# EAGLE schematic module_RevD_panelized (EAGLE 9.1.1)
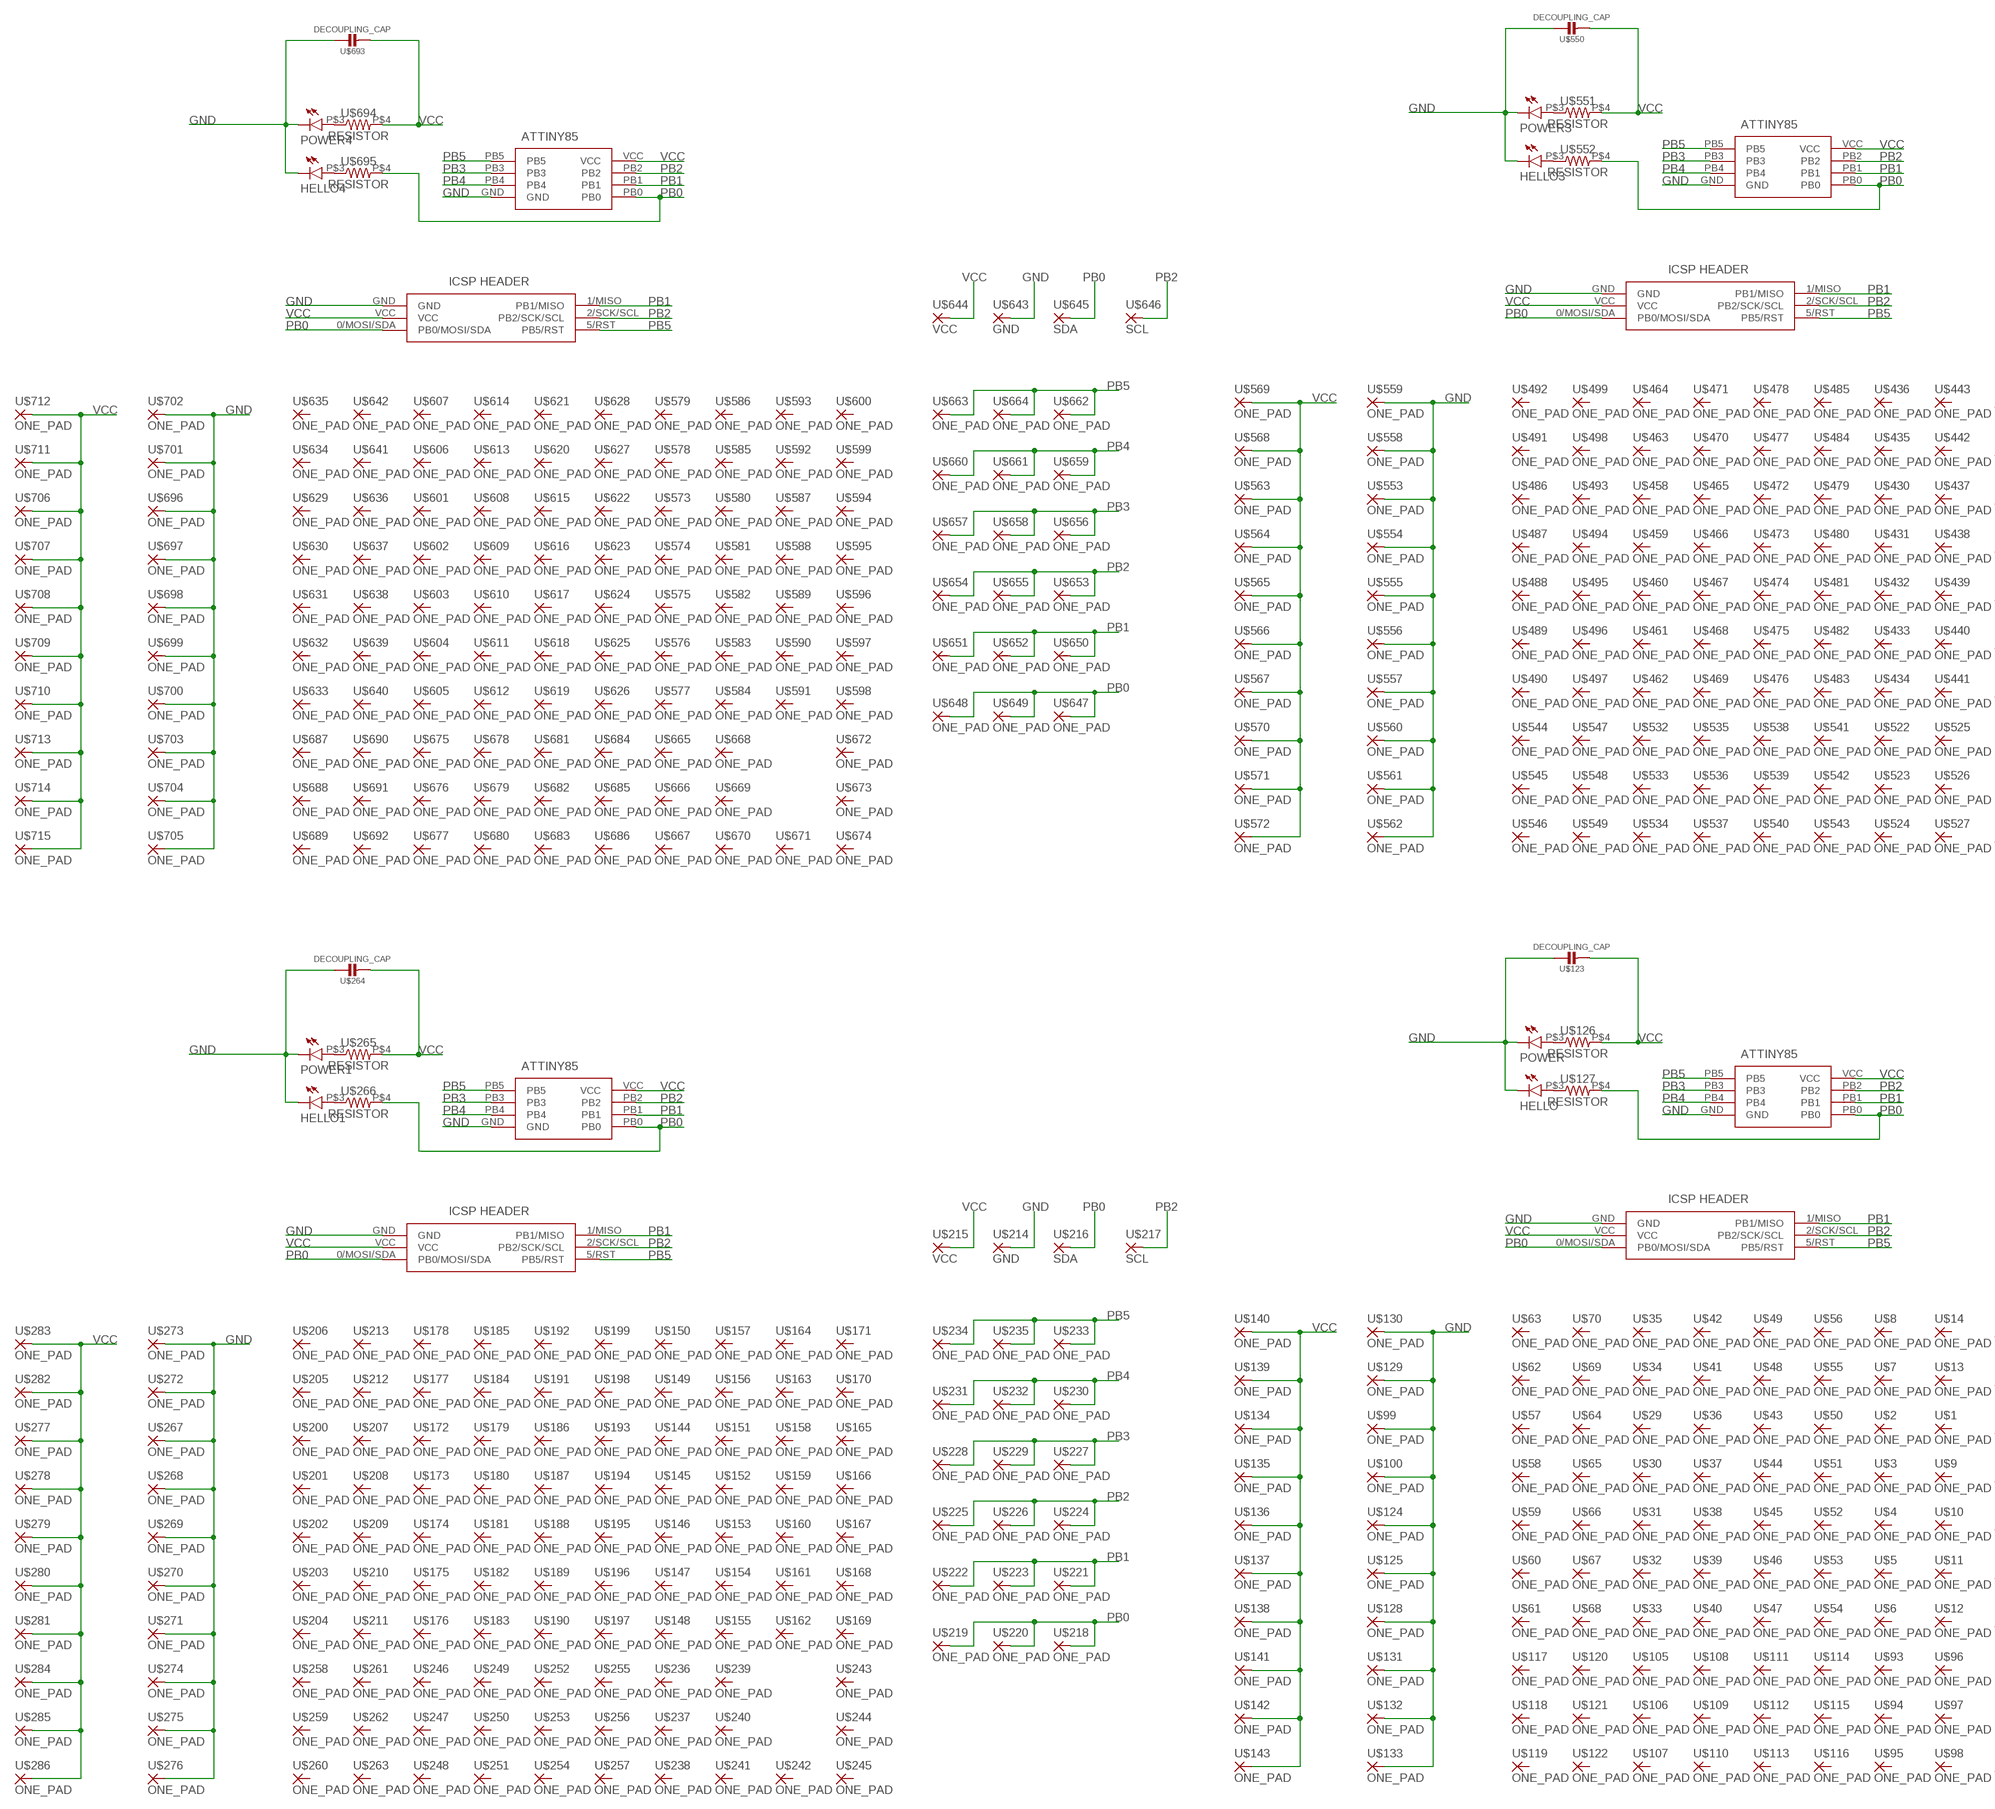
[diagram p0: schematic, sheet 1, part 1 of 2]
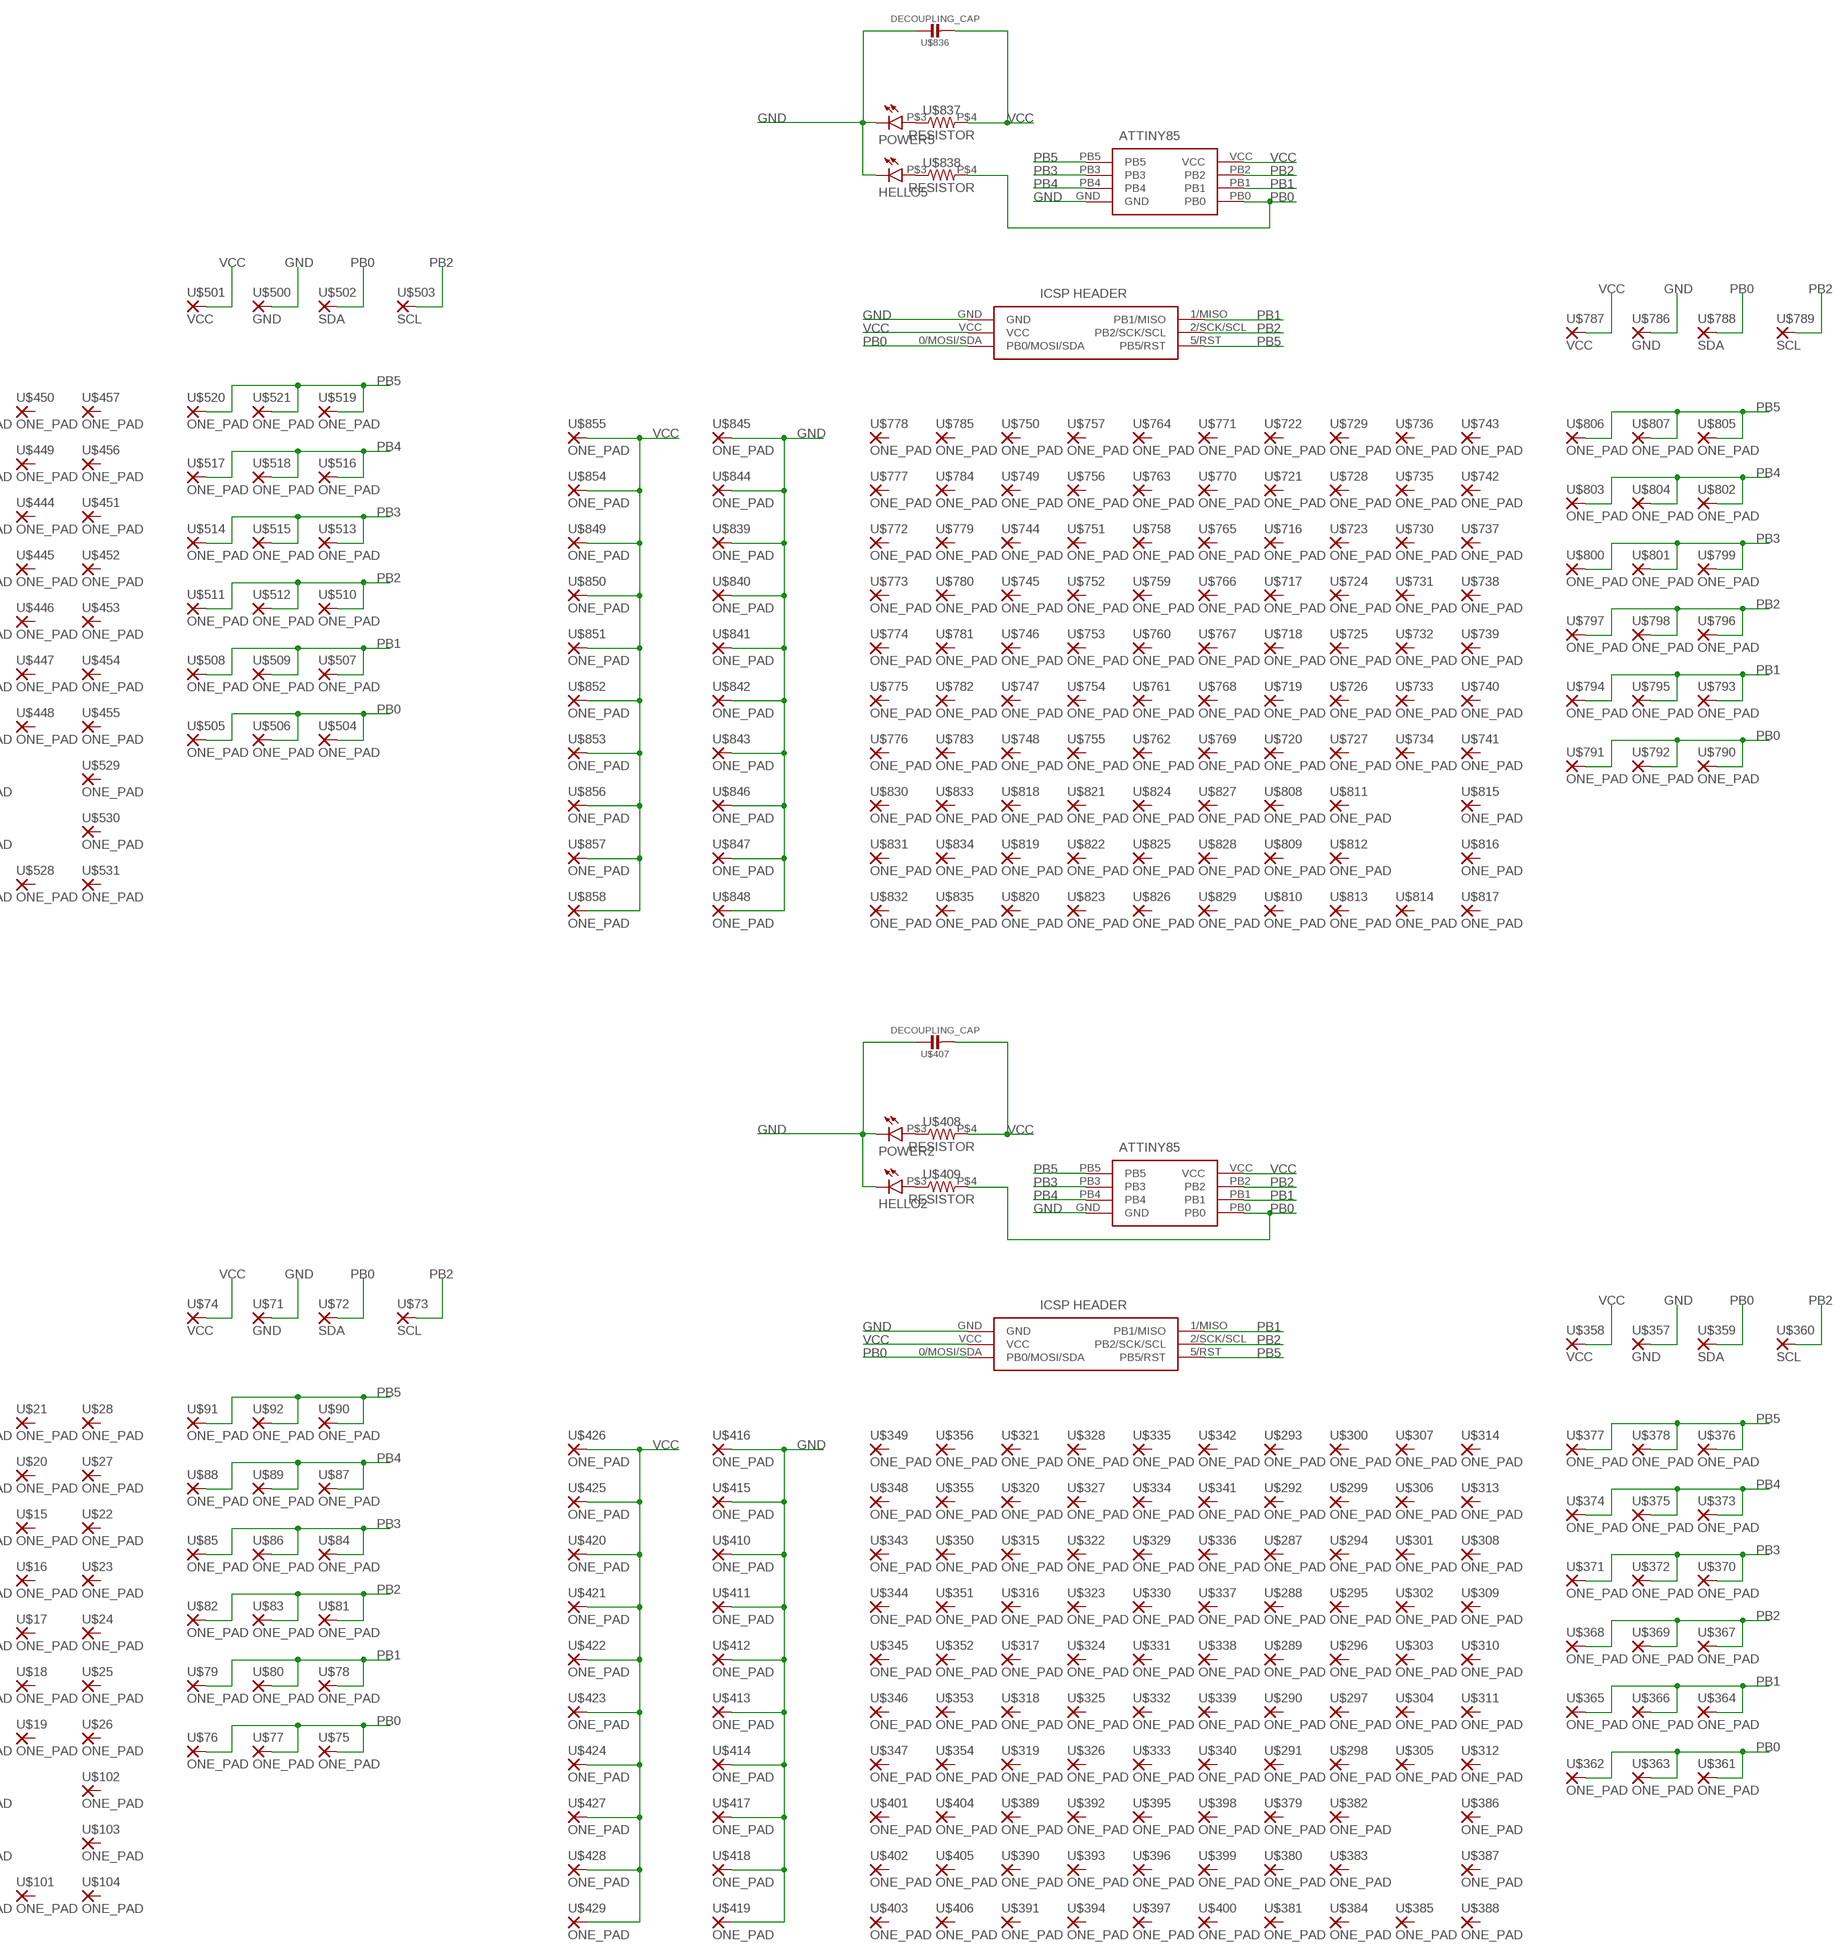
[diagram p1: schematic, sheet 1, part 2 of 2]

## Parts
HELLO  LED3MM  [LED3MM]
HELLO1  LED3MM  [LED3MM]
HELLO2  LED3MM  [LED3MM]
HELLO3  LED3MM  [LED3MM]
HELLO4  LED3MM  [LED3MM]
HELLO5  LED3MM  [LED3MM]
IC1  ATTINY85-20SU  [SOT127P798X216-8N]
IC2  ATTINY85-20SU  [SOT127P798X216-8N]
IC3  ATTINY85-20SU  [SOT127P798X216-8N]
IC4  ATTINY85-20SU  [SOT127P798X216-8N]
IC5  ATTINY85-20SU  [SOT127P798X216-8N]
IC6  ATTINY85-20SU  [SOT127P798X216-8N]
J1  M20-9980346  [HDRV6W64P254_2X3_762X508X868P]
J2  M20-9980346  [HDRV6W64P254_2X3_762X508X868P]
J3  M20-9980346  [HDRV6W64P254_2X3_762X508X868P]
J4  M20-9980346  [HDRV6W64P254_2X3_762X508X868P]
J5  M20-9980346  [HDRV6W64P254_2X3_762X508X868P]
J6  M20-9980346  [HDRV6W64P254_2X3_762X508X868P]
POWER  LED3MM  [LED3MM]
POWER1  LED3MM  [LED3MM]
POWER2  LED3MM  [LED3MM]
POWER3  LED3MM  [LED3MM]
POWER4  LED3MM  [LED3MM]
POWER5  LED3MM  [LED3MM]
U$1  ONE_PAD  [1X01]
U$2  ONE_PAD  [1X01]
U$3  ONE_PAD  [1X01]
U$4  ONE_PAD  [1X01]
U$5  ONE_PAD  [1X01]
U$6  ONE_PAD  [1X01]
U$7  ONE_PAD  [1X01]
U$8  ONE_PAD  [1X01]
U$9  ONE_PAD  [1X01]
U$10  ONE_PAD  [1X01]
U$11  ONE_PAD  [1X01]
U$12  ONE_PAD  [1X01]
U$13  ONE_PAD  [1X01]
U$14  ONE_PAD  [1X01]
U$15  ONE_PAD  [1X01]
U$16  ONE_PAD  [1X01]
U$17  ONE_PAD  [1X01]
U$18  ONE_PAD  [1X01]
U$19  ONE_PAD  [1X01]
U$20  ONE_PAD  [1X01]
U$21  ONE_PAD  [1X01]
U$22  ONE_PAD  [1X01]
U$23  ONE_PAD  [1X01]
U$24  ONE_PAD  [1X01]
U$25  ONE_PAD  [1X01]
U$26  ONE_PAD  [1X01]
U$27  ONE_PAD  [1X01]
U$28  ONE_PAD  [1X01]
U$29  ONE_PAD  [1X01]
U$30  ONE_PAD  [1X01]
U$31  ONE_PAD  [1X01]
U$32  ONE_PAD  [1X01]
U$33  ONE_PAD  [1X01]
U$34  ONE_PAD  [1X01]
U$35  ONE_PAD  [1X01]
U$36  ONE_PAD  [1X01]
U$37  ONE_PAD  [1X01]
U$38  ONE_PAD  [1X01]
U$39  ONE_PAD  [1X01]
U$40  ONE_PAD  [1X01]
U$41  ONE_PAD  [1X01]
U$42  ONE_PAD  [1X01]
U$43  ONE_PAD  [1X01]
U$44  ONE_PAD  [1X01]
U$45  ONE_PAD  [1X01]
U$46  ONE_PAD  [1X01]
U$47  ONE_PAD  [1X01]
U$48  ONE_PAD  [1X01]
U$49  ONE_PAD  [1X01]
U$50  ONE_PAD  [1X01]
U$51  ONE_PAD  [1X01]
U$52  ONE_PAD  [1X01]
U$53  ONE_PAD  [1X01]
U$54  ONE_PAD  [1X01]
U$55  ONE_PAD  [1X01]
U$56  ONE_PAD  [1X01]
U$57  ONE_PAD  [1X01]
U$58  ONE_PAD  [1X01]
U$59  ONE_PAD  [1X01]
U$60  ONE_PAD  [1X01]
U$61  ONE_PAD  [1X01]
U$62  ONE_PAD  [1X01]
U$63  ONE_PAD  [1X01]
U$64  ONE_PAD  [1X01]
U$65  ONE_PAD  [1X01]
U$66  ONE_PAD  [1X01]
U$67  ONE_PAD  [1X01]
U$68  ONE_PAD  [1X01]
U$69  ONE_PAD  [1X01]
U$70  ONE_PAD  [1X01]
U$71  GND  ONE_PAD  [1X01]
U$72  SDA  ONE_PAD  [1X01]
U$73  SCL  ONE_PAD  [1X01]
U$74  VCC  ONE_PAD  [1X01]
U$75  ONE_PAD  [1X01]
U$76  ONE_PAD  [1X01]
U$77  ONE_PAD  [1X01]
U$78  ONE_PAD  [1X01]
U$79  ONE_PAD  [1X01]
U$80  ONE_PAD  [1X01]
U$81  ONE_PAD  [1X01]
U$82  ONE_PAD  [1X01]
U$83  ONE_PAD  [1X01]
U$84  ONE_PAD  [1X01]
U$85  ONE_PAD  [1X01]
U$86  ONE_PAD  [1X01]
U$87  ONE_PAD  [1X01]
U$88  ONE_PAD  [1X01]
U$89  ONE_PAD  [1X01]
U$90  ONE_PAD  [1X01]
U$91  ONE_PAD  [1X01]
U$92  ONE_PAD  [1X01]
U$93  ONE_PAD  [1X01]
U$94  ONE_PAD  [1X01]
U$95  ONE_PAD  [1X01]
U$96  ONE_PAD  [1X01]
U$97  ONE_PAD  [1X01]
U$98  ONE_PAD  [1X01]
U$99  ONE_PAD  [1X01]
U$100  ONE_PAD  [1X01]
U$101  ONE_PAD  [1X01]
U$102  ONE_PAD  [1X01]
U$103  ONE_PAD  [1X01]
U$104  ONE_PAD  [1X01]
U$105  ONE_PAD  [1X01]
U$106  ONE_PAD  [1X01]
U$107  ONE_PAD  [1X01]
U$108  ONE_PAD  [1X01]
U$109  ONE_PAD  [1X01]
U$110  ONE_PAD  [1X01]
U$111  ONE_PAD  [1X01]
U$112  ONE_PAD  [1X01]
U$113  ONE_PAD  [1X01]
U$114  ONE_PAD  [1X01]
U$115  ONE_PAD  [1X01]
U$116  ONE_PAD  [1X01]
U$117  ONE_PAD  [1X01]
U$118  ONE_PAD  [1X01]
U$119  ONE_PAD  [1X01]
U$120  ONE_PAD  [1X01]
U$121  ONE_PAD  [1X01]
U$122  ONE_PAD  [1X01]
U$123  DECOUPLING_CAP  [DECOUPLING_CAP]
U$124  ONE_PAD  [1X01]
U$125  ONE_PAD  [1X01]
U$126  RESISTOR  [AXIAL-0.3]
U$127  RESISTOR  [AXIAL-0.3]
U$128  ONE_PAD  [1X01]
U$129  ONE_PAD  [1X01]
U$130  ONE_PAD  [1X01]
U$131  ONE_PAD  [1X01]
U$132  ONE_PAD  [1X01]
U$133  ONE_PAD  [1X01]
U$134  ONE_PAD  [1X01]
U$135  ONE_PAD  [1X01]
U$136  ONE_PAD  [1X01]
U$137  ONE_PAD  [1X01]
U$138  ONE_PAD  [1X01]
U$139  ONE_PAD  [1X01]
U$140  ONE_PAD  [1X01]
U$141  ONE_PAD  [1X01]
U$142  ONE_PAD  [1X01]
U$143  ONE_PAD  [1X01]
U$144  ONE_PAD  [1X01]
U$145  ONE_PAD  [1X01]
U$146  ONE_PAD  [1X01]
U$147  ONE_PAD  [1X01]
U$148  ONE_PAD  [1X01]
U$149  ONE_PAD  [1X01]
U$150  ONE_PAD  [1X01]
U$151  ONE_PAD  [1X01]
U$152  ONE_PAD  [1X01]
U$153  ONE_PAD  [1X01]
U$154  ONE_PAD  [1X01]
U$155  ONE_PAD  [1X01]
U$156  ONE_PAD  [1X01]
U$157  ONE_PAD  [1X01]
U$158  ONE_PAD  [1X01]
U$159  ONE_PAD  [1X01]
U$160  ONE_PAD  [1X01]
U$161  ONE_PAD  [1X01]
U$162  ONE_PAD  [1X01]
U$163  ONE_PAD  [1X01]
U$164  ONE_PAD  [1X01]
U$165  ONE_PAD  [1X01]
U$166  ONE_PAD  [1X01]
U$167  ONE_PAD  [1X01]
U$168  ONE_PAD  [1X01]
U$169  ONE_PAD  [1X01]
U$170  ONE_PAD  [1X01]
U$171  ONE_PAD  [1X01]
U$172  ONE_PAD  [1X01]
U$173  ONE_PAD  [1X01]
U$174  ONE_PAD  [1X01]
U$175  ONE_PAD  [1X01]
U$176  ONE_PAD  [1X01]
U$177  ONE_PAD  [1X01]
U$178  ONE_PAD  [1X01]
U$179  ONE_PAD  [1X01]
U$180  ONE_PAD  [1X01]
U$181  ONE_PAD  [1X01]
U$182  ONE_PAD  [1X01]
U$183  ONE_PAD  [1X01]
U$184  ONE_PAD  [1X01]
U$185  ONE_PAD  [1X01]
U$186  ONE_PAD  [1X01]
U$187  ONE_PAD  [1X01]
U$188  ONE_PAD  [1X01]
U$189  ONE_PAD  [1X01]
U$190  ONE_PAD  [1X01]
U$191  ONE_PAD  [1X01]
U$192  ONE_PAD  [1X01]
U$193  ONE_PAD  [1X01]
U$194  ONE_PAD  [1X01]
U$195  ONE_PAD  [1X01]
U$196  ONE_PAD  [1X01]
U$197  ONE_PAD  [1X01]
U$198  ONE_PAD  [1X01]
U$199  ONE_PAD  [1X01]
U$200  ONE_PAD  [1X01]
U$201  ONE_PAD  [1X01]
U$202  ONE_PAD  [1X01]
U$203  ONE_PAD  [1X01]
U$204  ONE_PAD  [1X01]
U$205  ONE_PAD  [1X01]
U$206  ONE_PAD  [1X01]
U$207  ONE_PAD  [1X01]
U$208  ONE_PAD  [1X01]
U$209  ONE_PAD  [1X01]
U$210  ONE_PAD  [1X01]
U$211  ONE_PAD  [1X01]
U$212  ONE_PAD  [1X01]
U$213  ONE_PAD  [1X01]
U$214  GND  ONE_PAD  [1X01]
U$215  VCC  ONE_PAD  [1X01]
U$216  SDA  ONE_PAD  [1X01]
U$217  SCL  ONE_PAD  [1X01]
U$218  ONE_PAD  [1X01]
U$219  ONE_PAD  [1X01]
U$220  ONE_PAD  [1X01]
U$221  ONE_PAD  [1X01]
U$222  ONE_PAD  [1X01]
U$223  ONE_PAD  [1X01]
U$224  ONE_PAD  [1X01]
U$225  ONE_PAD  [1X01]
U$226  ONE_PAD  [1X01]
U$227  ONE_PAD  [1X01]
U$228  ONE_PAD  [1X01]
U$229  ONE_PAD  [1X01]
U$230  ONE_PAD  [1X01]
U$231  ONE_PAD  [1X01]
U$232  ONE_PAD  [1X01]
U$233  ONE_PAD  [1X01]
U$234  ONE_PAD  [1X01]
U$235  ONE_PAD  [1X01]
U$236  ONE_PAD  [1X01]
U$237  ONE_PAD  [1X01]
U$238  ONE_PAD  [1X01]
U$239  ONE_PAD  [1X01]
U$240  ONE_PAD  [1X01]
U$241  ONE_PAD  [1X01]
U$242  ONE_PAD  [1X01]
U$243  ONE_PAD  [1X01]
U$244  ONE_PAD  [1X01]
U$245  ONE_PAD  [1X01]
U$246  ONE_PAD  [1X01]
U$247  ONE_PAD  [1X01]
U$248  ONE_PAD  [1X01]
U$249  ONE_PAD  [1X01]
U$250  ONE_PAD  [1X01]
U$251  ONE_PAD  [1X01]
U$252  ONE_PAD  [1X01]
U$253  ONE_PAD  [1X01]
U$254  ONE_PAD  [1X01]
U$255  ONE_PAD  [1X01]
U$256  ONE_PAD  [1X01]
U$257  ONE_PAD  [1X01]
U$258  ONE_PAD  [1X01]
U$259  ONE_PAD  [1X01]
U$260  ONE_PAD  [1X01]
U$261  ONE_PAD  [1X01]
U$262  ONE_PAD  [1X01]
U$263  ONE_PAD  [1X01]
U$264  DECOUPLING_CAP  [DECOUPLING_CAP]
U$265  RESISTOR  [AXIAL-0.3]
U$266  RESISTOR  [AXIAL-0.3]
U$267  ONE_PAD  [1X01]
U$268  ONE_PAD  [1X01]
U$269  ONE_PAD  [1X01]
U$270  ONE_PAD  [1X01]
U$271  ONE_PAD  [1X01]
U$272  ONE_PAD  [1X01]
U$273  ONE_PAD  [1X01]
U$274  ONE_PAD  [1X01]
U$275  ONE_PAD  [1X01]
U$276  ONE_PAD  [1X01]
U$277  ONE_PAD  [1X01]
U$278  ONE_PAD  [1X01]
U$279  ONE_PAD  [1X01]
U$280  ONE_PAD  [1X01]
U$281  ONE_PAD  [1X01]
U$282  ONE_PAD  [1X01]
U$283  ONE_PAD  [1X01]
U$284  ONE_PAD  [1X01]
U$285  ONE_PAD  [1X01]
U$286  ONE_PAD  [1X01]
U$287  ONE_PAD  [1X01]
U$288  ONE_PAD  [1X01]
U$289  ONE_PAD  [1X01]
U$290  ONE_PAD  [1X01]
U$291  ONE_PAD  [1X01]
U$292  ONE_PAD  [1X01]
U$293  ONE_PAD  [1X01]
U$294  ONE_PAD  [1X01]
U$295  ONE_PAD  [1X01]
U$296  ONE_PAD  [1X01]
U$297  ONE_PAD  [1X01]
U$298  ONE_PAD  [1X01]
U$299  ONE_PAD  [1X01]
U$300  ONE_PAD  [1X01]
U$301  ONE_PAD  [1X01]
U$302  ONE_PAD  [1X01]
U$303  ONE_PAD  [1X01]
U$304  ONE_PAD  [1X01]
U$305  ONE_PAD  [1X01]
U$306  ONE_PAD  [1X01]
U$307  ONE_PAD  [1X01]
U$308  ONE_PAD  [1X01]
U$309  ONE_PAD  [1X01]
U$310  ONE_PAD  [1X01]
U$311  ONE_PAD  [1X01]
U$312  ONE_PAD  [1X01]
U$313  ONE_PAD  [1X01]
U$314  ONE_PAD  [1X01]
U$315  ONE_PAD  [1X01]
U$316  ONE_PAD  [1X01]
U$317  ONE_PAD  [1X01]
U$318  ONE_PAD  [1X01]
U$319  ONE_PAD  [1X01]
U$320  ONE_PAD  [1X01]
U$321  ONE_PAD  [1X01]
U$322  ONE_PAD  [1X01]
U$323  ONE_PAD  [1X01]
U$324  ONE_PAD  [1X01]
U$325  ONE_PAD  [1X01]
U$326  ONE_PAD  [1X01]
U$327  ONE_PAD  [1X01]
U$328  ONE_PAD  [1X01]
U$329  ONE_PAD  [1X01]
U$330  ONE_PAD  [1X01]
U$331  ONE_PAD  [1X01]
U$332  ONE_PAD  [1X01]
U$333  ONE_PAD  [1X01]
U$334  ONE_PAD  [1X01]
U$335  ONE_PAD  [1X01]
U$336  ONE_PAD  [1X01]
U$337  ONE_PAD  [1X01]
U$338  ONE_PAD  [1X01]
U$339  ONE_PAD  [1X01]
U$340  ONE_PAD  [1X01]
U$341  ONE_PAD  [1X01]
U$342  ONE_PAD  [1X01]
U$343  ONE_PAD  [1X01]
U$344  ONE_PAD  [1X01]
U$345  ONE_PAD  [1X01]
U$346  ONE_PAD  [1X01]
U$347  ONE_PAD  [1X01]
U$348  ONE_PAD  [1X01]
U$349  ONE_PAD  [1X01]
U$350  ONE_PAD  [1X01]
U$351  ONE_PAD  [1X01]
U$352  ONE_PAD  [1X01]
U$353  ONE_PAD  [1X01]
U$354  ONE_PAD  [1X01]
U$355  ONE_PAD  [1X01]
U$356  ONE_PAD  [1X01]
U$357  GND  ONE_PAD  [1X01]
U$358  VCC  ONE_PAD  [1X01]
U$359  SDA  ONE_PAD  [1X01]
U$360  SCL  ONE_PAD  [1X01]
U$361  ONE_PAD  [1X01]
U$362  ONE_PAD  [1X01]
U$363  ONE_PAD  [1X01]
U$364  ONE_PAD  [1X01]
U$365  ONE_PAD  [1X01]
U$366  ONE_PAD  [1X01]
U$367  ONE_PAD  [1X01]
U$368  ONE_PAD  [1X01]
U$369  ONE_PAD  [1X01]
U$370  ONE_PAD  [1X01]
U$371  ONE_PAD  [1X01]
U$372  ONE_PAD  [1X01]
U$373  ONE_PAD  [1X01]
U$374  ONE_PAD  [1X01]
U$375  ONE_PAD  [1X01]
U$376  ONE_PAD  [1X01]
U$377  ONE_PAD  [1X01]
U$378  ONE_PAD  [1X01]
U$379  ONE_PAD  [1X01]
U$380  ONE_PAD  [1X01]
U$381  ONE_PAD  [1X01]
U$382  ONE_PAD  [1X01]
U$383  ONE_PAD  [1X01]
U$384  ONE_PAD  [1X01]
U$385  ONE_PAD  [1X01]
U$386  ONE_PAD  [1X01]
U$387  ONE_PAD  [1X01]
U$388  ONE_PAD  [1X01]
U$389  ONE_PAD  [1X01]
U$390  ONE_PAD  [1X01]
U$391  ONE_PAD  [1X01]
U$392  ONE_PAD  [1X01]
U$393  ONE_PAD  [1X01]
U$394  ONE_PAD  [1X01]
U$395  ONE_PAD  [1X01]
U$396  ONE_PAD  [1X01]
U$397  ONE_PAD  [1X01]
U$398  ONE_PAD  [1X01]
U$399  ONE_PAD  [1X01]
U$400  ONE_PAD  [1X01]
U$401  ONE_PAD  [1X01]
U$402  ONE_PAD  [1X01]
U$403  ONE_PAD  [1X01]
U$404  ONE_PAD  [1X01]
U$405  ONE_PAD  [1X01]
U$406  ONE_PAD  [1X01]
U$407  DECOUPLING_CAP  [DECOUPLING_CAP]
U$408  RESISTOR  [AXIAL-0.3]
U$409  RESISTOR  [AXIAL-0.3]
U$410  ONE_PAD  [1X01]
U$411  ONE_PAD  [1X01]
U$412  ONE_PAD  [1X01]
U$413  ONE_PAD  [1X01]
U$414  ONE_PAD  [1X01]
U$415  ONE_PAD  [1X01]
U$416  ONE_PAD  [1X01]
U$417  ONE_PAD  [1X01]
U$418  ONE_PAD  [1X01]
U$419  ONE_PAD  [1X01]
U$420  ONE_PAD  [1X01]
U$421  ONE_PAD  [1X01]
U$422  ONE_PAD  [1X01]
U$423  ONE_PAD  [1X01]
U$424  ONE_PAD  [1X01]
U$425  ONE_PAD  [1X01]
U$426  ONE_PAD  [1X01]
U$427  ONE_PAD  [1X01]
U$428  ONE_PAD  [1X01]
U$429  ONE_PAD  [1X01]
U$430  ONE_PAD  [1X01]
U$431  ONE_PAD  [1X01]
U$432  ONE_PAD  [1X01]
U$433  ONE_PAD  [1X01]
U$434  ONE_PAD  [1X01]
U$435  ONE_PAD  [1X01]
U$436  ONE_PAD  [1X01]
U$437  ONE_PAD  [1X01]
U$438  ONE_PAD  [1X01]
U$439  ONE_PAD  [1X01]
U$440  ONE_PAD  [1X01]
U$441  ONE_PAD  [1X01]
U$442  ONE_PAD  [1X01]
U$443  ONE_PAD  [1X01]
U$444  ONE_PAD  [1X01]
U$445  ONE_PAD  [1X01]
U$446  ONE_PAD  [1X01]
U$447  ONE_PAD  [1X01]
U$448  ONE_PAD  [1X01]
U$449  ONE_PAD  [1X01]
U$450  ONE_PAD  [1X01]
U$451  ONE_PAD  [1X01]
U$452  ONE_PAD  [1X01]
U$453  ONE_PAD  [1X01]
U$454  ONE_PAD  [1X01]
U$455  ONE_PAD  [1X01]
U$456  ONE_PAD  [1X01]
U$457  ONE_PAD  [1X01]
U$458  ONE_PAD  [1X01]
U$459  ONE_PAD  [1X01]
U$460  ONE_PAD  [1X01]
U$461  ONE_PAD  [1X01]
U$462  ONE_PAD  [1X01]
U$463  ONE_PAD  [1X01]
U$464  ONE_PAD  [1X01]
U$465  ONE_PAD  [1X01]
U$466  ONE_PAD  [1X01]
U$467  ONE_PAD  [1X01]
U$468  ONE_PAD  [1X01]
U$469  ONE_PAD  [1X01]
U$470  ONE_PAD  [1X01]
U$471  ONE_PAD  [1X01]
U$472  ONE_PAD  [1X01]
U$473  ONE_PAD  [1X01]
U$474  ONE_PAD  [1X01]
U$475  ONE_PAD  [1X01]
U$476  ONE_PAD  [1X01]
U$477  ONE_PAD  [1X01]
U$478  ONE_PAD  [1X01]
U$479  ONE_PAD  [1X01]
U$480  ONE_PAD  [1X01]
U$481  ONE_PAD  [1X01]
U$482  ONE_PAD  [1X01]
U$483  ONE_PAD  [1X01]
U$484  ONE_PAD  [1X01]
U$485  ONE_PAD  [1X01]
U$486  ONE_PAD  [1X01]
U$487  ONE_PAD  [1X01]
U$488  ONE_PAD  [1X01]
U$489  ONE_PAD  [1X01]
U$490  ONE_PAD  [1X01]
U$491  ONE_PAD  [1X01]
U$492  ONE_PAD  [1X01]
U$493  ONE_PAD  [1X01]
U$494  ONE_PAD  [1X01]
U$495  ONE_PAD  [1X01]
U$496  ONE_PAD  [1X01]
U$497  ONE_PAD  [1X01]
U$498  ONE_PAD  [1X01]
U$499  ONE_PAD  [1X01]
U$500  GND  ONE_PAD  [1X01]
U$501  VCC  ONE_PAD  [1X01]
U$502  SDA  ONE_PAD  [1X01]
U$503  SCL  ONE_PAD  [1X01]
U$504  ONE_PAD  [1X01]
U$505  ONE_PAD  [1X01]
U$506  ONE_PAD  [1X01]
U$507  ONE_PAD  [1X01]
U$508  ONE_PAD  [1X01]
U$509  ONE_PAD  [1X01]
U$510  ONE_PAD  [1X01]
U$511  ONE_PAD  [1X01]
U$512  ONE_PAD  [1X01]
U$513  ONE_PAD  [1X01]
U$514  ONE_PAD  [1X01]
U$515  ONE_PAD  [1X01]
U$516  ONE_PAD  [1X01]
U$517  ONE_PAD  [1X01]
U$518  ONE_PAD  [1X01]
U$519  ONE_PAD  [1X01]
U$520  ONE_PAD  [1X01]
U$521  ONE_PAD  [1X01]
U$522  ONE_PAD  [1X01]
U$523  ONE_PAD  [1X01]
U$524  ONE_PAD  [1X01]
U$525  ONE_PAD  [1X01]
U$526  ONE_PAD  [1X01]
U$527  ONE_PAD  [1X01]
U$528  ONE_PAD  [1X01]
U$529  ONE_PAD  [1X01]
U$530  ONE_PAD  [1X01]
U$531  ONE_PAD  [1X01]
U$532  ONE_PAD  [1X01]
U$533  ONE_PAD  [1X01]
U$534  ONE_PAD  [1X01]
U$535  ONE_PAD  [1X01]
U$536  ONE_PAD  [1X01]
U$537  ONE_PAD  [1X01]
U$538  ONE_PAD  [1X01]
U$539  ONE_PAD  [1X01]
U$540  ONE_PAD  [1X01]
U$541  ONE_PAD  [1X01]
U$542  ONE_PAD  [1X01]
U$543  ONE_PAD  [1X01]
U$544  ONE_PAD  [1X01]
U$545  ONE_PAD  [1X01]
U$546  ONE_PAD  [1X01]
U$547  ONE_PAD  [1X01]
U$548  ONE_PAD  [1X01]
U$549  ONE_PAD  [1X01]
U$550  DECOUPLING_CAP  [DECOUPLING_CAP]
U$551  RESISTOR  [AXIAL-0.3]
U$552  RESISTOR  [AXIAL-0.3]
U$553  ONE_PAD  [1X01]
U$554  ONE_PAD  [1X01]
U$555  ONE_PAD  [1X01]
U$556  ONE_PAD  [1X01]
U$557  ONE_PAD  [1X01]
U$558  ONE_PAD  [1X01]
U$559  ONE_PAD  [1X01]
U$560  ONE_PAD  [1X01]
U$561  ONE_PAD  [1X01]
U$562  ONE_PAD  [1X01]
U$563  ONE_PAD  [1X01]
U$564  ONE_PAD  [1X01]
U$565  ONE_PAD  [1X01]
U$566  ONE_PAD  [1X01]
U$567  ONE_PAD  [1X01]
U$568  ONE_PAD  [1X01]
U$569  ONE_PAD  [1X01]
U$570  ONE_PAD  [1X01]
U$571  ONE_PAD  [1X01]
U$572  ONE_PAD  [1X01]
U$573  ONE_PAD  [1X01]
U$574  ONE_PAD  [1X01]
U$575  ONE_PAD  [1X01]
U$576  ONE_PAD  [1X01]
U$577  ONE_PAD  [1X01]
U$578  ONE_PAD  [1X01]
U$579  ONE_PAD  [1X01]
U$580  ONE_PAD  [1X01]
U$581  ONE_PAD  [1X01]
U$582  ONE_PAD  [1X01]
U$583  ONE_PAD  [1X01]
U$584  ONE_PAD  [1X01]
U$585  ONE_PAD  [1X01]
U$586  ONE_PAD  [1X01]
U$587  ONE_PAD  [1X01]
U$588  ONE_PAD  [1X01]
U$589  ONE_PAD  [1X01]
U$590  ONE_PAD  [1X01]
U$591  ONE_PAD  [1X01]
U$592  ONE_PAD  [1X01]
U$593  ONE_PAD  [1X01]
U$594  ONE_PAD  [1X01]
U$595  ONE_PAD  [1X01]
U$596  ONE_PAD  [1X01]
U$597  ONE_PAD  [1X01]
U$598  ONE_PAD  [1X01]
U$599  ONE_PAD  [1X01]
U$600  ONE_PAD  [1X01]
U$601  ONE_PAD  [1X01]
U$602  ONE_PAD  [1X01]
U$603  ONE_PAD  [1X01]
U$604  ONE_PAD  [1X01]
U$605  ONE_PAD  [1X01]
U$606  ONE_PAD  [1X01]
U$607  ONE_PAD  [1X01]
U$608  ONE_PAD  [1X01]
U$609  ONE_PAD  [1X01]
U$610  ONE_PAD  [1X01]
U$611  ONE_PAD  [1X01]
U$612  ONE_PAD  [1X01]
U$613  ONE_PAD  [1X01]
U$614  ONE_PAD  [1X01]
U$615  ONE_PAD  [1X01]
U$616  ONE_PAD  [1X01]
U$617  ONE_PAD  [1X01]
U$618  ONE_PAD  [1X01]
U$619  ONE_PAD  [1X01]
U$620  ONE_PAD  [1X01]
U$621  ONE_PAD  [1X01]
U$622  ONE_PAD  [1X01]
U$623  ONE_PAD  [1X01]
U$624  ONE_PAD  [1X01]
U$625  ONE_PAD  [1X01]
U$626  ONE_PAD  [1X01]
U$627  ONE_PAD  [1X01]
U$628  ONE_PAD  [1X01]
U$629  ONE_PAD  [1X01]
U$630  ONE_PAD  [1X01]
U$631  ONE_PAD  [1X01]
U$632  ONE_PAD  [1X01]
U$633  ONE_PAD  [1X01]
U$634  ONE_PAD  [1X01]
U$635  ONE_PAD  [1X01]
U$636  ONE_PAD  [1X01]
U$637  ONE_PAD  [1X01]
U$638  ONE_PAD  [1X01]
U$639  ONE_PAD  [1X01]
U$640  ONE_PAD  [1X01]
U$641  ONE_PAD  [1X01]
U$642  ONE_PAD  [1X01]
U$643  GND  ONE_PAD  [1X01]
U$644  VCC  ONE_PAD  [1X01]
U$645  SDA  ONE_PAD  [1X01]
U$646  SCL  ONE_PAD  [1X01]
U$647  ONE_PAD  [1X01]
U$648  ONE_PAD  [1X01]
U$649  ONE_PAD  [1X01]
U$650  ONE_PAD  [1X01]
U$651  ONE_PAD  [1X01]
U$652  ONE_PAD  [1X01]
U$653  ONE_PAD  [1X01]
U$654  ONE_PAD  [1X01]
U$655  ONE_PAD  [1X01]
U$656  ONE_PAD  [1X01]
U$657  ONE_PAD  [1X01]
U$658  ONE_PAD  [1X01]
U$659  ONE_PAD  [1X01]
U$660  ONE_PAD  [1X01]
U$661  ONE_PAD  [1X01]
U$662  ONE_PAD  [1X01]
U$663  ONE_PAD  [1X01]
U$664  ONE_PAD  [1X01]
U$665  ONE_PAD  [1X01]
U$666  ONE_PAD  [1X01]
U$667  ONE_PAD  [1X01]
U$668  ONE_PAD  [1X01]
U$669  ONE_PAD  [1X01]
U$670  ONE_PAD  [1X01]
U$671  ONE_PAD  [1X01]
U$672  ONE_PAD  [1X01]
U$673  ONE_PAD  [1X01]
U$674  ONE_PAD  [1X01]
U$675  ONE_PAD  [1X01]
U$676  ONE_PAD  [1X01]
U$677  ONE_PAD  [1X01]
U$678  ONE_PAD  [1X01]
U$679  ONE_PAD  [1X01]
U$680  ONE_PAD  [1X01]
U$681  ONE_PAD  [1X01]
U$682  ONE_PAD  [1X01]
U$683  ONE_PAD  [1X01]
U$684  ONE_PAD  [1X01]
U$685  ONE_PAD  [1X01]
U$686  ONE_PAD  [1X01]
U$687  ONE_PAD  [1X01]
U$688  ONE_PAD  [1X01]
U$689  ONE_PAD  [1X01]
U$690  ONE_PAD  [1X01]
U$691  ONE_PAD  [1X01]
U$692  ONE_PAD  [1X01]
U$693  DECOUPLING_CAP  [DECOUPLING_CAP]
U$694  RESISTOR  [AXIAL-0.3]
U$695  RESISTOR  [AXIAL-0.3]
U$696  ONE_PAD  [1X01]
U$697  ONE_PAD  [1X01]
U$698  ONE_PAD  [1X01]
U$699  ONE_PAD  [1X01]
U$700  ONE_PAD  [1X01]
U$701  ONE_PAD  [1X01]
U$702  ONE_PAD  [1X01]
U$703  ONE_PAD  [1X01]
U$704  ONE_PAD  [1X01]
U$705  ONE_PAD  [1X01]
U$706  ONE_PAD  [1X01]
U$707  ONE_PAD  [1X01]
U$708  ONE_PAD  [1X01]
U$709  ONE_PAD  [1X01]
U$710  ONE_PAD  [1X01]
U$711  ONE_PAD  [1X01]
U$712  ONE_PAD  [1X01]
U$713  ONE_PAD  [1X01]
U$714  ONE_PAD  [1X01]
U$715  ONE_PAD  [1X01]
U$716  ONE_PAD  [1X01]
U$717  ONE_PAD  [1X01]
U$718  ONE_PAD  [1X01]
U$719  ONE_PAD  [1X01]
U$720  ONE_PAD  [1X01]
U$721  ONE_PAD  [1X01]
U$722  ONE_PAD  [1X01]
U$723  ONE_PAD  [1X01]
U$724  ONE_PAD  [1X01]
U$725  ONE_PAD  [1X01]
U$726  ONE_PAD  [1X01]
U$727  ONE_PAD  [1X01]
U$728  ONE_PAD  [1X01]
U$729  ONE_PAD  [1X01]
U$730  ONE_PAD  [1X01]
U$731  ONE_PAD  [1X01]
U$732  ONE_PAD  [1X01]
U$733  ONE_PAD  [1X01]
U$734  ONE_PAD  [1X01]
U$735  ONE_PAD  [1X01]
U$736  ONE_PAD  [1X01]
U$737  ONE_PAD  [1X01]
U$738  ONE_PAD  [1X01]
U$739  ONE_PAD  [1X01]
U$740  ONE_PAD  [1X01]
U$741  ONE_PAD  [1X01]
U$742  ONE_PAD  [1X01]
U$743  ONE_PAD  [1X01]
U$744  ONE_PAD  [1X01]
U$745  ONE_PAD  [1X01]
U$746  ONE_PAD  [1X01]
U$747  ONE_PAD  [1X01]
U$748  ONE_PAD  [1X01]
U$749  ONE_PAD  [1X01]
U$750  ONE_PAD  [1X01]
U$751  ONE_PAD  [1X01]
U$752  ONE_PAD  [1X01]
U$753  ONE_PAD  [1X01]
U$754  ONE_PAD  [1X01]
U$755  ONE_PAD  [1X01]
U$756  ONE_PAD  [1X01]
U$757  ONE_PAD  [1X01]
U$758  ONE_PAD  [1X01]
U$759  ONE_PAD  [1X01]
U$760  ONE_PAD  [1X01]
U$761  ONE_PAD  [1X01]
U$762  ONE_PAD  [1X01]
U$763  ONE_PAD  [1X01]
U$764  ONE_PAD  [1X01]
U$765  ONE_PAD  [1X01]
U$766  ONE_PAD  [1X01]
U$767  ONE_PAD  [1X01]
U$768  ONE_PAD  [1X01]
U$769  ONE_PAD  [1X01]
U$770  ONE_PAD  [1X01]
U$771  ONE_PAD  [1X01]
U$772  ONE_PAD  [1X01]
U$773  ONE_PAD  [1X01]
U$774  ONE_PAD  [1X01]
U$775  ONE_PAD  [1X01]
U$776  ONE_PAD  [1X01]
U$777  ONE_PAD  [1X01]
U$778  ONE_PAD  [1X01]
U$779  ONE_PAD  [1X01]
U$780  ONE_PAD  [1X01]
U$781  ONE_PAD  [1X01]
U$782  ONE_PAD  [1X01]
U$783  ONE_PAD  [1X01]
U$784  ONE_PAD  [1X01]
U$785  ONE_PAD  [1X01]
U$786  GND  ONE_PAD  [1X01]
U$787  VCC  ONE_PAD  [1X01]
U$788  SDA  ONE_PAD  [1X01]
U$789  SCL  ONE_PAD  [1X01]
U$790  ONE_PAD  [1X01]
U$791  ONE_PAD  [1X01]
U$792  ONE_PAD  [1X01]
U$793  ONE_PAD  [1X01]
U$794  ONE_PAD  [1X01]
U$795  ONE_PAD  [1X01]
U$796  ONE_PAD  [1X01]
U$797  ONE_PAD  [1X01]
U$798  ONE_PAD  [1X01]
U$799  ONE_PAD  [1X01]
U$800  ONE_PAD  [1X01]
U$801  ONE_PAD  [1X01]
U$802  ONE_PAD  [1X01]
U$803  ONE_PAD  [1X01]
U$804  ONE_PAD  [1X01]
U$805  ONE_PAD  [1X01]
U$806  ONE_PAD  [1X01]
U$807  ONE_PAD  [1X01]
U$808  ONE_PAD  [1X01]
U$809  ONE_PAD  [1X01]
U$810  ONE_PAD  [1X01]
U$811  ONE_PAD  [1X01]
U$812  ONE_PAD  [1X01]
U$813  ONE_PAD  [1X01]
U$814  ONE_PAD  [1X01]
U$815  ONE_PAD  [1X01]
U$816  ONE_PAD  [1X01]
U$817  ONE_PAD  [1X01]
U$818  ONE_PAD  [1X01]
U$819  ONE_PAD  [1X01]
U$820  ONE_PAD  [1X01]
U$821  ONE_PAD  [1X01]
U$822  ONE_PAD  [1X01]
U$823  ONE_PAD  [1X01]
U$824  ONE_PAD  [1X01]
U$825  ONE_PAD  [1X01]
U$826  ONE_PAD  [1X01]
U$827  ONE_PAD  [1X01]
U$828  ONE_PAD  [1X01]
U$829  ONE_PAD  [1X01]
U$830  ONE_PAD  [1X01]
U$831  ONE_PAD  [1X01]
U$832  ONE_PAD  [1X01]
U$833  ONE_PAD  [1X01]
U$834  ONE_PAD  [1X01]
U$835  ONE_PAD  [1X01]
U$836  DECOUPLING_CAP  [DECOUPLING_CAP]
U$837  RESISTOR  [AXIAL-0.3]
U$838  RESISTOR  [AXIAL-0.3]
U$839  ONE_PAD  [1X01]
U$840  ONE_PAD  [1X01]
U$841  ONE_PAD  [1X01]
U$842  ONE_PAD  [1X01]
U$843  ONE_PAD  [1X01]
U$844  ONE_PAD  [1X01]
U$845  ONE_PAD  [1X01]
U$846  ONE_PAD  [1X01]
U$847  ONE_PAD  [1X01]
U$848  ONE_PAD  [1X01]
U$849  ONE_PAD  [1X01]
U$850  ONE_PAD  [1X01]
U$851  ONE_PAD  [1X01]
U$852  ONE_PAD  [1X01]
U$853  ONE_PAD  [1X01]
U$854  ONE_PAD  [1X01]
U$855  ONE_PAD  [1X01]
U$856  ONE_PAD  [1X01]
U$857  ONE_PAD  [1X01]
U$858  ONE_PAD  [1X01]

## Nets
GND [GND]: HELLO1.NEG HELLO2.NEG HELLO3.NEG HELLO4.NEG HELLO5.NEG HELLO.NEG IC1.GND IC2.GND IC3.GND IC4.GND IC5.GND IC6.GND J1.GND J2.GND J3.GND J4.GND J5.GND J6.GND POWER1.NEG POWER2.NEG POWER3.NEG POWER4.NEG POWER5.NEG POWER.NEG U$71.P$1(P) U$99.P$1(P) U$100.P$1(P) U$123.P$1 U$124.P$1(P) U$125.P$1(P) U$128.P$1(P) U$129.P$1(P) U$130.P$1(P) U$131.P$1(P) U$132.P$1(P) U$133.P$1(P) U$214.P$1(P) U$264.P$1 U$267.P$1(P) U$268.P$1(P) U$269.P$1(P) U$270.P$1(P) U$271.P$1(P) U$272.P$1(P) U$273.P$1(P) U$274.P$1(P) U$275.P$1(P) U$276.P$1(P) U$357.P$1(P) U$407.P$1 U$410.P$1(P) U$411.P$1(P) U$412.P$1(P) U$413.P$1(P) U$414.P$1(P) U$415.P$1(P) U$416.P$1(P) U$417.P$1(P) U$418.P$1(P) U$419.P$1(P) U$500.P$1(P) U$550.P$1 U$553.P$1(P) U$554.P$1(P) U$555.P$1(P) U$556.P$1(P) U$557.P$1(P) U$558.P$1(P) U$559.P$1(P) U$560.P$1(P) U$561.P$1(P) U$562.P$1(P) U$643.P$1(P) U$693.P$1 U$696.P$1(P) U$697.P$1(P) U$698.P$1(P) U$699.P$1(P) U$700.P$1(P) U$701.P$1(P) U$702.P$1(P) U$703.P$1(P) U$704.P$1(P) U$705.P$1(P) U$786.P$1(P) U$836.P$1 U$839.P$1(P) U$840.P$1(P) U$841.P$1(P) U$842.P$1(P) U$843.P$1(P) U$844.P$1(P) U$845.P$1(P) U$846.P$1(P) U$847.P$1(P) U$848.P$1(P)
N$1: POWER.POS U$126.P$3
N$2: HELLO.POS U$127.P$3
N$3: POWER1.POS U$265.P$3
N$4: HELLO1.POS U$266.P$3
N$5: POWER2.POS U$408.P$3
N$6: HELLO2.POS U$409.P$3
N$7: POWER3.POS U$551.P$3
N$8: HELLO3.POS U$552.P$3
N$9: POWER4.POS U$694.P$3
N$10: HELLO4.POS U$695.P$3
N$11: POWER5.POS U$837.P$3
N$12: HELLO5.POS U$838.P$3
PB0: IC1.PB0 IC2.PB0 IC3.PB0 IC4.PB0 IC5.PB0 IC6.PB0 J1.0/MOSI/SDA(PB0/MOSI/SDA) J2.0/MOSI/SDA(PB0/MOSI/SDA) J3.0/MOSI/SDA(PB0/MOSI/SDA) J4.0/MOSI/SDA(PB0/MOSI/SDA) J5.0/MOSI/SDA(PB0/MOSI/SDA) J6.0/MOSI/SDA(PB0/MOSI/SDA) U$72.P$1(P) U$75.P$1(P) U$76.P$1(P) U$77.P$1(P) U$127.P$4 U$216.P$1(P) U$218.P$1(P) U$219.P$1(P) U$220.P$1(P) U$266.P$4 U$359.P$1(P) U$361.P$1(P) U$362.P$1(P) U$363.P$1(P) U$409.P$4 U$502.P$1(P) U$504.P$1(P) U$505.P$1(P) U$506.P$1(P) U$552.P$4 U$645.P$1(P) U$647.P$1(P) U$648.P$1(P) U$649.P$1(P) U$695.P$4 U$788.P$1(P) U$790.P$1(P) U$791.P$1(P) U$792.P$1(P) U$838.P$4
PB1: IC1.PB1 IC2.PB1 IC3.PB1 IC4.PB1 IC5.PB1 IC6.PB1 J1.1/MISO(PB1/MISO) J2.1/MISO(PB1/MISO) J3.1/MISO(PB1/MISO) J4.1/MISO(PB1/MISO) J5.1/MISO(PB1/MISO) J6.1/MISO(PB1/MISO) U$78.P$1(P) U$79.P$1(P) U$80.P$1(P) U$221.P$1(P) U$222.P$1(P) U$223.P$1(P) U$364.P$1(P) U$365.P$1(P) U$366.P$1(P) U$507.P$1(P) U$508.P$1(P) U$509.P$1(P) U$650.P$1(P) U$651.P$1(P) U$652.P$1(P) U$793.P$1(P) U$794.P$1(P) U$795.P$1(P)
PB2: IC1.PB2 IC2.PB2 IC3.PB2 IC4.PB2 IC5.PB2 IC6.PB2 J1.2/SCK/SCL(PB2/SCK/SCL) J2.2/SCK/SCL(PB2/SCK/SCL) J3.2/SCK/SCL(PB2/SCK/SCL) J4.2/SCK/SCL(PB2/SCK/SCL) J5.2/SCK/SCL(PB2/SCK/SCL) J6.2/SCK/SCL(PB2/SCK/SCL) U$73.P$1(P) U$81.P$1(P) U$82.P$1(P) U$83.P$1(P) U$217.P$1(P) U$224.P$1(P) U$225.P$1(P) U$226.P$1(P) U$360.P$1(P) U$367.P$1(P) U$368.P$1(P) U$369.P$1(P) U$503.P$1(P) U$510.P$1(P) U$511.P$1(P) U$512.P$1(P) U$646.P$1(P) U$653.P$1(P) U$654.P$1(P) U$655.P$1(P) U$789.P$1(P) U$796.P$1(P) U$797.P$1(P) U$798.P$1(P)
PB3: IC1.PB3 IC2.PB3 IC3.PB3 IC4.PB3 IC5.PB3 IC6.PB3 U$84.P$1(P) U$85.P$1(P) U$86.P$1(P) U$227.P$1(P) U$228.P$1(P) U$229.P$1(P) U$370.P$1(P) U$371.P$1(P) U$372.P$1(P) U$513.P$1(P) U$514.P$1(P) U$515.P$1(P) U$656.P$1(P) U$657.P$1(P) U$658.P$1(P) U$799.P$1(P) U$800.P$1(P) U$801.P$1(P)
PB4: IC1.PB4 IC2.PB4 IC3.PB4 IC4.PB4 IC5.PB4 IC6.PB4 U$87.P$1(P) U$88.P$1(P) U$89.P$1(P) U$230.P$1(P) U$231.P$1(P) U$232.P$1(P) U$373.P$1(P) U$374.P$1(P) U$375.P$1(P) U$516.P$1(P) U$517.P$1(P) U$518.P$1(P) U$659.P$1(P) U$660.P$1(P) U$661.P$1(P) U$802.P$1(P) U$803.P$1(P) U$804.P$1(P)
PB5: IC1.PB5 IC2.PB5 IC3.PB5 IC4.PB5 IC5.PB5 IC6.PB5 J1.5/RST(PB5/RST) J2.5/RST(PB5/RST) J3.5/RST(PB5/RST) J4.5/RST(PB5/RST) J5.5/RST(PB5/RST) J6.5/RST(PB5/RST) U$90.P$1(P) U$91.P$1(P) U$92.P$1(P) U$233.P$1(P) U$234.P$1(P) U$235.P$1(P) U$376.P$1(P) U$377.P$1(P) U$378.P$1(P) U$519.P$1(P) U$520.P$1(P) U$521.P$1(P) U$662.P$1(P) U$663.P$1(P) U$664.P$1(P) U$805.P$1(P) U$806.P$1(P) U$807.P$1(P)
VCC [VCC]: IC1.VCC IC2.VCC IC3.VCC IC4.VCC IC5.VCC IC6.VCC J1.VCC J2.VCC J3.VCC J4.VCC J5.VCC J6.VCC U$74.P$1(P) U$123.P$2 U$126.P$4 U$134.P$1(P) U$135.P$1(P) U$136.P$1(P) U$137.P$1(P) U$138.P$1(P) U$139.P$1(P) U$140.P$1(P) U$141.P$1(P) U$142.P$1(P) U$143.P$1(P) U$215.P$1(P) U$264.P$2 U$265.P$4 U$277.P$1(P) U$278.P$1(P) U$279.P$1(P) U$280.P$1(P) U$281.P$1(P) U$282.P$1(P) U$283.P$1(P) U$284.P$1(P) U$285.P$1(P) U$286.P$1(P) U$358.P$1(P) U$407.P$2 U$408.P$4 U$420.P$1(P) U$421.P$1(P) U$422.P$1(P) U$423.P$1(P) U$424.P$1(P) U$425.P$1(P) U$426.P$1(P) U$427.P$1(P) U$428.P$1(P) U$429.P$1(P) U$501.P$1(P) U$550.P$2 U$551.P$4 U$563.P$1(P) U$564.P$1(P) U$565.P$1(P) U$566.P$1(P) U$567.P$1(P) U$568.P$1(P) U$569.P$1(P) U$570.P$1(P) U$571.P$1(P) U$572.P$1(P) U$644.P$1(P) U$693.P$2 U$694.P$4 U$706.P$1(P) U$707.P$1(P) U$708.P$1(P) U$709.P$1(P) U$710.P$1(P) U$711.P$1(P) U$712.P$1(P) U$713.P$1(P) U$714.P$1(P) U$715.P$1(P) U$787.P$1(P) U$836.P$2 U$837.P$4 U$849.P$1(P) U$850.P$1(P) U$851.P$1(P) U$852.P$1(P) U$853.P$1(P) U$854.P$1(P) U$855.P$1(P) U$856.P$1(P) U$857.P$1(P) U$858.P$1(P)
Unconnected: U$1.P$1(P) U$2.P$1(P) U$3.P$1(P) U$4.P$1(P) U$5.P$1(P) U$6.P$1(P) U$7.P$1(P) U$8.P$1(P) U$9.P$1(P) U$10.P$1(P) U$11.P$1(P) U$12.P$1(P) U$13.P$1(P) U$14.P$1(P) U$15.P$1(P) U$16.P$1(P) U$17.P$1(P) U$18.P$1(P) U$19.P$1(P) U$20.P$1(P) U$21.P$1(P) U$22.P$1(P) U$23.P$1(P) U$24.P$1(P) U$25.P$1(P) U$26.P$1(P) U$27.P$1(P) U$28.P$1(P) U$29.P$1(P) U$30.P$1(P) U$31.P$1(P) U$32.P$1(P) U$33.P$1(P) U$34.P$1(P) U$35.P$1(P) U$36.P$1(P) U$37.P$1(P) U$38.P$1(P) U$39.P$1(P) U$40.P$1(P) U$41.P$1(P) U$42.P$1(P) U$43.P$1(P) U$44.P$1(P) U$45.P$1(P) U$46.P$1(P) U$47.P$1(P) U$48.P$1(P) U$49.P$1(P) U$50.P$1(P) U$51.P$1(P) U$52.P$1(P) U$53.P$1(P) U$54.P$1(P) U$55.P$1(P) U$56.P$1(P) U$57.P$1(P) U$58.P$1(P) U$59.P$1(P) U$60.P$1(P) U$61.P$1(P) U$62.P$1(P) U$63.P$1(P) U$64.P$1(P) U$65.P$1(P) U$66.P$1(P) U$67.P$1(P) U$68.P$1(P) U$69.P$1(P) U$70.P$1(P) U$93.P$1(P) U$94.P$1(P) U$95.P$1(P) U$96.P$1(P) U$97.P$1(P) U$98.P$1(P) U$101.P$1(P) U$102.P$1(P) U$103.P$1(P) U$104.P$1(P) U$105.P$1(P) U$106.P$1(P) U$107.P$1(P) U$108.P$1(P) U$109.P$1(P) U$110.P$1(P) U$111.P$1(P) U$112.P$1(P) U$113.P$1(P) U$114.P$1(P) U$115.P$1(P) U$116.P$1(P) U$117.P$1(P) U$118.P$1(P) U$119.P$1(P) U$120.P$1(P) U$121.P$1(P) U$122.P$1(P) U$144.P$1(P) U$145.P$1(P) U$146.P$1(P) U$147.P$1(P) U$148.P$1(P) U$149.P$1(P) U$150.P$1(P) U$151.P$1(P) U$152.P$1(P) U$153.P$1(P) U$154.P$1(P) U$155.P$1(P) U$156.P$1(P) U$157.P$1(P) U$158.P$1(P) U$159.P$1(P) U$160.P$1(P) U$161.P$1(P) U$162.P$1(P) U$163.P$1(P) U$164.P$1(P) U$165.P$1(P) U$166.P$1(P) U$167.P$1(P) U$168.P$1(P) U$169.P$1(P) U$170.P$1(P) U$171.P$1(P) U$172.P$1(P) U$173.P$1(P) U$174.P$1(P) U$175.P$1(P) U$176.P$1(P) U$177.P$1(P) U$178.P$1(P) U$179.P$1(P) U$180.P$1(P) U$181.P$1(P) U$182.P$1(P) U$183.P$1(P) U$184.P$1(P) U$185.P$1(P) U$186.P$1(P) U$187.P$1(P) U$188.P$1(P) U$189.P$1(P) U$190.P$1(P) U$191.P$1(P) U$192.P$1(P) U$193.P$1(P) U$194.P$1(P) U$195.P$1(P) U$196.P$1(P) U$197.P$1(P) U$198.P$1(P) U$199.P$1(P) U$200.P$1(P) U$201.P$1(P) U$202.P$1(P) U$203.P$1(P) U$204.P$1(P) U$205.P$1(P) U$206.P$1(P) U$207.P$1(P) U$208.P$1(P) U$209.P$1(P) U$210.P$1(P) U$211.P$1(P) U$212.P$1(P) U$213.P$1(P) U$236.P$1(P) U$237.P$1(P) U$238.P$1(P) U$239.P$1(P) U$240.P$1(P) U$241.P$1(P) U$242.P$1(P) U$243.P$1(P) U$244.P$1(P) U$245.P$1(P) U$246.P$1(P) U$247.P$1(P) U$248.P$1(P) U$249.P$1(P) U$250.P$1(P) U$251.P$1(P) U$252.P$1(P) U$253.P$1(P) U$254.P$1(P) U$255.P$1(P) U$256.P$1(P) U$257.P$1(P) U$258.P$1(P) U$259.P$1(P) U$260.P$1(P) U$261.P$1(P) U$262.P$1(P) U$263.P$1(P) U$287.P$1(P) U$288.P$1(P) U$289.P$1(P) U$290.P$1(P) U$291.P$1(P) U$292.P$1(P) U$293.P$1(P) U$294.P$1(P) U$295.P$1(P) U$296.P$1(P) U$297.P$1(P) U$298.P$1(P) U$299.P$1(P) U$300.P$1(P) U$301.P$1(P) U$302.P$1(P) U$303.P$1(P) U$304.P$1(P) U$305.P$1(P) U$306.P$1(P) U$307.P$1(P) U$308.P$1(P) U$309.P$1(P) U$310.P$1(P) U$311.P$1(P) U$312.P$1(P) U$313.P$1(P) U$314.P$1(P) U$315.P$1(P) U$316.P$1(P) U$317.P$1(P) U$318.P$1(P) U$319.P$1(P) U$320.P$1(P) U$321.P$1(P) U$322.P$1(P) U$323.P$1(P) U$324.P$1(P) U$325.P$1(P) U$326.P$1(P) U$327.P$1(P) U$328.P$1(P) U$329.P$1(P) U$330.P$1(P) U$331.P$1(P) U$332.P$1(P) U$333.P$1(P) U$334.P$1(P) U$335.P$1(P) U$336.P$1(P) U$337.P$1(P) U$338.P$1(P) U$339.P$1(P) U$340.P$1(P) U$341.P$1(P) U$342.P$1(P) U$343.P$1(P) U$344.P$1(P) U$345.P$1(P) U$346.P$1(P) U$347.P$1(P) U$348.P$1(P) U$349.P$1(P) U$350.P$1(P) U$351.P$1(P) U$352.P$1(P) U$353.P$1(P) U$354.P$1(P) U$355.P$1(P) U$356.P$1(P) U$379.P$1(P) U$380.P$1(P) U$381.P$1(P) U$382.P$1(P) U$383.P$1(P) U$384.P$1(P) U$385.P$1(P) U$386.P$1(P) U$387.P$1(P) U$388.P$1(P) U$389.P$1(P) U$390.P$1(P) U$391.P$1(P) U$392.P$1(P) U$393.P$1(P) U$394.P$1(P) U$395.P$1(P) U$396.P$1(P) U$397.P$1(P) U$398.P$1(P) U$399.P$1(P) U$400.P$1(P) U$401.P$1(P) U$402.P$1(P) U$403.P$1(P) U$404.P$1(P) U$405.P$1(P) U$406.P$1(P) U$430.P$1(P) U$431.P$1(P) U$432.P$1(P) U$433.P$1(P) U$434.P$1(P) U$435.P$1(P) U$436.P$1(P) U$437.P$1(P) U$438.P$1(P) U$439.P$1(P) U$440.P$1(P) U$441.P$1(P) U$442.P$1(P) U$443.P$1(P) U$444.P$1(P) U$445.P$1(P) U$446.P$1(P) U$447.P$1(P) U$448.P$1(P) U$449.P$1(P) U$450.P$1(P) U$451.P$1(P) U$452.P$1(P) U$453.P$1(P) U$454.P$1(P) U$455.P$1(P) U$456.P$1(P) U$457.P$1(P) U$458.P$1(P) U$459.P$1(P) U$460.P$1(P) U$461.P$1(P) U$462.P$1(P) U$463.P$1(P) U$464.P$1(P) U$465.P$1(P) U$466.P$1(P) U$467.P$1(P) U$468.P$1(P) U$469.P$1(P) U$470.P$1(P) U$471.P$1(P) U$472.P$1(P) U$473.P$1(P) U$474.P$1(P) U$475.P$1(P) U$476.P$1(P) U$477.P$1(P) U$478.P$1(P) U$479.P$1(P) U$480.P$1(P) U$481.P$1(P) U$482.P$1(P) U$483.P$1(P) U$484.P$1(P) U$485.P$1(P) U$486.P$1(P) U$487.P$1(P) U$488.P$1(P) U$489.P$1(P) U$490.P$1(P) U$491.P$1(P) U$492.P$1(P) U$493.P$1(P) U$494.P$1(P) U$495.P$1(P) U$496.P$1(P) U$497.P$1(P) U$498.P$1(P) U$499.P$1(P) U$522.P$1(P) U$523.P$1(P) U$524.P$1(P) U$525.P$1(P) U$526.P$1(P) U$527.P$1(P) U$528.P$1(P) U$529.P$1(P) U$530.P$1(P) U$531.P$1(P) U$532.P$1(P) U$533.P$1(P) U$534.P$1(P) U$535.P$1(P) U$536.P$1(P) U$537.P$1(P) U$538.P$1(P) U$539.P$1(P) U$540.P$1(P) U$541.P$1(P) U$542.P$1(P) U$543.P$1(P) U$544.P$1(P) U$545.P$1(P) U$546.P$1(P) U$547.P$1(P) U$548.P$1(P) U$549.P$1(P) U$573.P$1(P) U$574.P$1(P) U$575.P$1(P) U$576.P$1(P) U$577.P$1(P) U$578.P$1(P) U$579.P$1(P) U$580.P$1(P) U$581.P$1(P) U$582.P$1(P) U$583.P$1(P) U$584.P$1(P) U$585.P$1(P) U$586.P$1(P) U$587.P$1(P) U$588.P$1(P) U$589.P$1(P) U$590.P$1(P) U$591.P$1(P) U$592.P$1(P) U$593.P$1(P) U$594.P$1(P) U$595.P$1(P) U$596.P$1(P) U$597.P$1(P) U$598.P$1(P) U$599.P$1(P) U$600.P$1(P) U$601.P$1(P) U$602.P$1(P) U$603.P$1(P) U$604.P$1(P) U$605.P$1(P) U$606.P$1(P) U$607.P$1(P) U$608.P$1(P) U$609.P$1(P) U$610.P$1(P) U$611.P$1(P) U$612.P$1(P) U$613.P$1(P) U$614.P$1(P) U$615.P$1(P) U$616.P$1(P) U$617.P$1(P) U$618.P$1(P) U$619.P$1(P) U$620.P$1(P) U$621.P$1(P) U$622.P$1(P) U$623.P$1(P) U$624.P$1(P) U$625.P$1(P) U$626.P$1(P) U$627.P$1(P) U$628.P$1(P) U$629.P$1(P) U$630.P$1(P) U$631.P$1(P) U$632.P$1(P) U$633.P$1(P) U$634.P$1(P) U$635.P$1(P) U$636.P$1(P) U$637.P$1(P) U$638.P$1(P) U$639.P$1(P) U$640.P$1(P) U$641.P$1(P) U$642.P$1(P) U$665.P$1(P) U$666.P$1(P) U$667.P$1(P) U$668.P$1(P) U$669.P$1(P) U$670.P$1(P) U$671.P$1(P) U$672.P$1(P) U$673.P$1(P) U$674.P$1(P) U$675.P$1(P) U$676.P$1(P) U$677.P$1(P) U$678.P$1(P) U$679.P$1(P) U$680.P$1(P) U$681.P$1(P) U$682.P$1(P) U$683.P$1(P) U$684.P$1(P) U$685.P$1(P) U$686.P$1(P) U$687.P$1(P) U$688.P$1(P) U$689.P$1(P) U$690.P$1(P) U$691.P$1(P) U$692.P$1(P) U$716.P$1(P) U$717.P$1(P) U$718.P$1(P) U$719.P$1(P) U$720.P$1(P) U$721.P$1(P) U$722.P$1(P) U$723.P$1(P) U$724.P$1(P) U$725.P$1(P) U$726.P$1(P) U$727.P$1(P) U$728.P$1(P) U$729.P$1(P) U$730.P$1(P) U$731.P$1(P) U$732.P$1(P) U$733.P$1(P) U$734.P$1(P) U$735.P$1(P) U$736.P$1(P) U$737.P$1(P) U$738.P$1(P) U$739.P$1(P) U$740.P$1(P) U$741.P$1(P) U$742.P$1(P) U$743.P$1(P) U$744.P$1(P) U$745.P$1(P) U$746.P$1(P) U$747.P$1(P) U$748.P$1(P) U$749.P$1(P) U$750.P$1(P) U$751.P$1(P) U$752.P$1(P) U$753.P$1(P) U$754.P$1(P) U$755.P$1(P) U$756.P$1(P) U$757.P$1(P) U$758.P$1(P) U$759.P$1(P) U$760.P$1(P) U$761.P$1(P) U$762.P$1(P) U$763.P$1(P) U$764.P$1(P) U$765.P$1(P) U$766.P$1(P) U$767.P$1(P) U$768.P$1(P) U$769.P$1(P) U$770.P$1(P) U$771.P$1(P) U$772.P$1(P) U$773.P$1(P) U$774.P$1(P) U$775.P$1(P) U$776.P$1(P) U$777.P$1(P) U$778.P$1(P) U$779.P$1(P) U$780.P$1(P) U$781.P$1(P) U$782.P$1(P) U$783.P$1(P) U$784.P$1(P) U$785.P$1(P) U$808.P$1(P) U$809.P$1(P) U$810.P$1(P) U$811.P$1(P) U$812.P$1(P) U$813.P$1(P) U$814.P$1(P) U$815.P$1(P) U$816.P$1(P) U$817.P$1(P) U$818.P$1(P) U$819.P$1(P) U$820.P$1(P) U$821.P$1(P) U$822.P$1(P) U$823.P$1(P) U$824.P$1(P) U$825.P$1(P) U$826.P$1(P) U$827.P$1(P) U$828.P$1(P) U$829.P$1(P) U$830.P$1(P) U$831.P$1(P) U$832.P$1(P) U$833.P$1(P) U$834.P$1(P) U$835.P$1(P)

## Library data of the parts
HELLO HELLO1-HELLO5 POWER POWER1-POWER5 = BadgeParts:LED3MM
IC1-IC6 = BadgeParts:ATTINY85-20SU: MICROCHIP - ATTINY85-20SU - MICROCONTROLLER MCU, 8 BIT, ATTINY, 20MHZ, SOIC-8 Source: Datasheet <https://componentsearchengine.com/Datasheets/2/ATTINY85-20SU.pdf>; ARROW_PART_NUMBER: ATTINY85-20SU; ARROW_PRICE/STOCK: https://www.arrow.com/en/products/attiny85-20su/microchip-technology; DESCRIPTION: MICROCHIP - ATTINY85-20SU - MICROCONTROLLER MCU, 8 BIT, ATTINY, 20MHZ, SOIC-8; HEIGHT: 2.16mm; MANUFACTURER_NAME: Microchip; MANUFACTURER_PART_NUMBER: ATTINY85-20SU; RS_PART_NUMBER: 1331674; RS_PRICE/STOCK: http://uk.rs-online.com/web/p/products/1331674
J1-J6 = BadgeParts:M20-9980346: 03+03 DIL Vertical Pin Header HARWIN M20 Series, 2.54mm Pitch 6 Way 2 Row Straight PCB Header, Solder Termination, 3A Source: Datasheet <https://cdn.harwin.com/pdfs/M20-998.pdf?utm_source=3D_PDF&utm_medium=3D_PDF&utm_campaign=3D_PDF>; ARROW_PART_NUMBER: M20-9980346; ARROW_PRICE/STOCK: http://uk.rs-online.com/web/p/products/7457046P; DESCRIPTION: 03+03 DIL Vertical Pin Header HARWIN M20 Series, 2.54mm Pitch 6 Way 2 Row Straight PCB Header, Solder Termination, 3A; HEIGHT: 8.68mm; MANUFACTURER_NAME: HARWIN; MANUFACTURER_PART_NUMBER: M20-9980346; RS_PART_NUMBER: 7457046P; RS_PRICE/STOCK: http://uk.rs-online.com/web/p/products/7457046P
U$1-U$122 U$124 U$125 U$128-U$263 U$267-U$406 U$410-U$549 U$553-U$692 U$696-U$835 U$839-U$858 = BadgeParts:ONE_PAD
U$123 U$264 U$407 U$550 U$693 U$836 = BadgeParts:DECOUPLING_CAP
U$126 U$127 U$265 U$266 U$408 U$409 U$551 U$552 U$694 U$695 U$837 U$838 = BadgeParts:RESISTOR

## Net classes
0 default: width 0.254 mm, clearance 0.254 mm
1 VCC: width 0.381 mm, clearance 0.254 mm
2 GND: width 0.381 mm, clearance 0.254 mm